# EAGLE design PCM2904DAC_ADC (EAGLE 8.3.2)
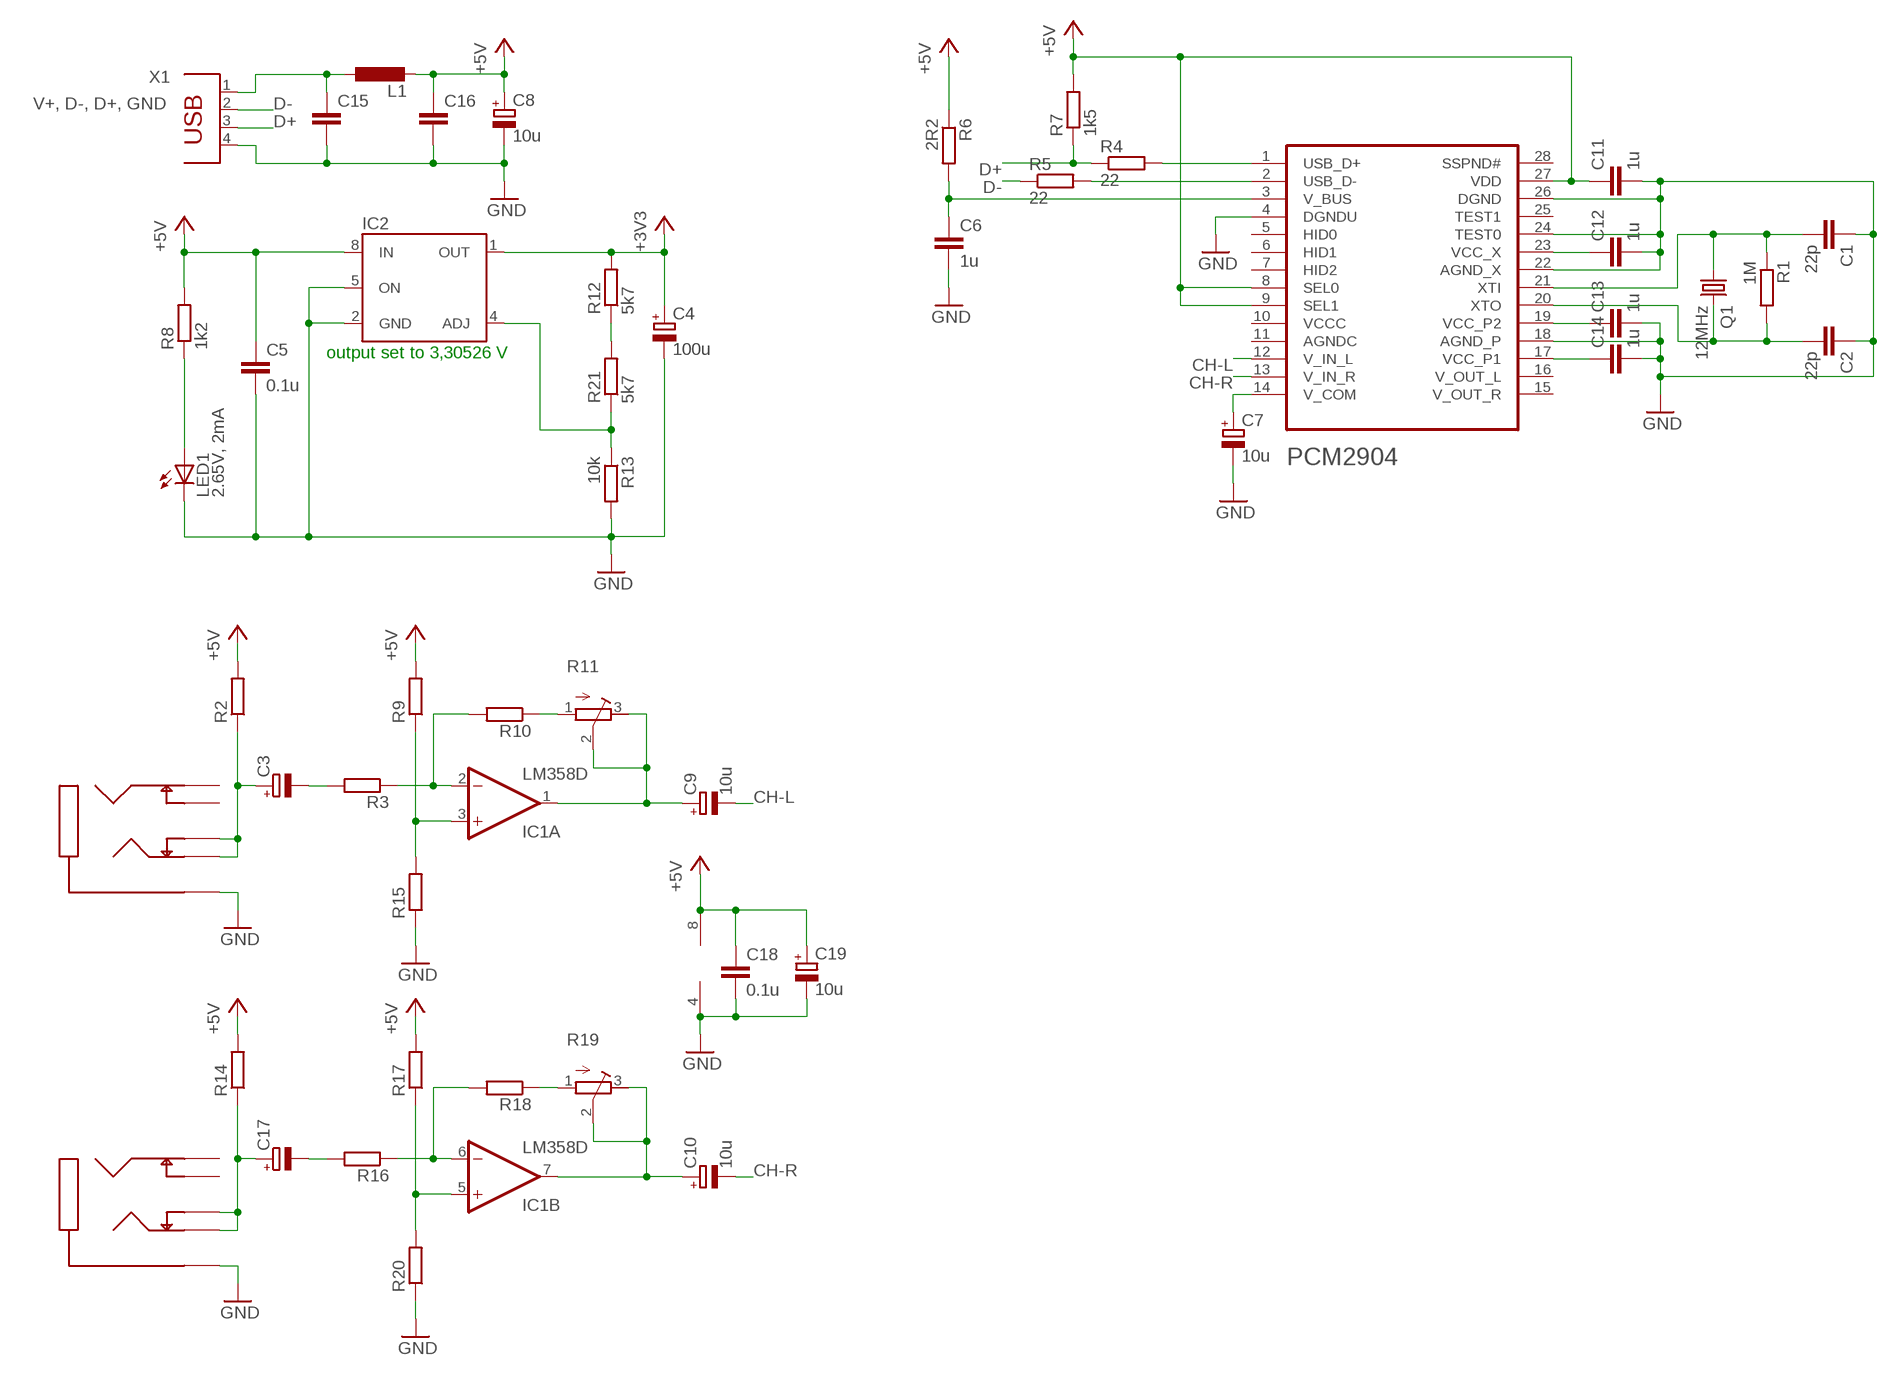
[diagram p0: schematic, sheet 1]

## Parts
C1  22p  C-EUC1206  [C1206]
C2  22p  C-EUC1206  [C1206]
C3  CPOL-EU153CLV-0505  [153CLV-0505]
C4  100u  CPOL-EU153CLV-0807  [153CLV-0807]
C5  0.1u  C-EUC1206  [C1206]
C6  1u  C-EUC1206  [C1206]
C7  10u  CPOL-EU153CLV-0505  [153CLV-0505]
C8  10u  CPOL-EU153CLV-0505  [153CLV-0505]
C9  10u  CPOL-EU153CLV-0505  [153CLV-0505]
C10  10u  CPOL-EU153CLV-0505  [153CLV-0505]
C11  1u  C-EUC1206  [C1206]
C12  1u  C-EUC1206  [C1206]
C13  1u  C-EUC1206  [C1206]
C14  1u  C-EUC1206  [C1206]
C15  C-EUC1206K  [C1206K]
C16  C-EUC1206K  [C1206K]
C17  CPOL-EU153CLV-0505  [153CLV-0505]
C18  0.1u  C-EUC1206  [C1206]
C19  10u  CPOL-EU153CLV-0505  [153CLV-0505]
IC1  LM358D  [SO08]
IC2  LM2931-ADJM  [SO08]
L1  L-EU0207/7  [0207/7]
LED1  2.65V, 2mA  LEDCHIPLED_0805  [CHIPLED_0805]
PCM2904  PCM2904  [SSOP28]
Q1  12MHz  CRYSTALHC49U-V  [HC49U-V]
R1  1M  R-EU_R1206  [R1206]
R2  R-EU_R1206W  [R1206W]
R3  R-EU_R1206W  [R1206W]
R4  22  R-EU_R1206  [R1206]
R5  22  R-EU_R1206  [R1206]
R6  2R2  R-EU_R1206  [R1206]
R7  1k5  R-EU_R1206  [R1206]
R8  1k2  R-EU_R1206  [R1206]
R9  R-EU_R1206W  [R1206W]
R10  R-EU_R1206W  [R1206W]
R11  R-TRIMM64W  [RTRIM64W]
R12  5k7  R-EU_R1206  [R1206]
R13  10k  R-EU_R1206  [R1206]
R14  R-EU_R1206W  [R1206W]
R15  R-EU_R1206W  [R1206W]
R16  R-EU_R1206W  [R1206W]
R17  R-EU_R1206W  [R1206W]
R18  R-EU_R1206W  [R1206W]
R19  R-TRIMM64W  [RTRIM64W]
R20  R-EU_R1206W  [R1206W]
R21  5k7  R-EU_R1206  [R1206]
U$1  1/8STEREO  [1/8STEREO]
U$8  1/8STEREO  [1/8STEREO]
X1  V+, D-, D+, GND  PN61729  [PN61729]

## Nets
+3V3: C4.+ IC2.1(OUT) R12.2
+5V: C5.1 C8.+ C11.1 C16.1 C18.1 C19.+ IC1.8(P:V+) IC2.8(IN) L1.2 PCM2904.8(SEL0) PCM2904.9(SEL1) PCM2904.27(VDD) R2.2 R6.1 R7.2 R8.2 R9.2 R14.2 R17.2
CH-L: C9.- PCM2904.12(V_IN_L)
CH-R: C10.- PCM2904.13(V_IN_R)
D+: R4.1 R7.1 X1.3
D-: R5.1 X1.2
GND: C1.1 C2.1 C4.- C5.2 C6.2 C7.- C8.- C11.2 C12.2 C13.2 C14.2 C15.2 C16.2 C18.2 C19.- IC1.4(P:V-) IC2.2(GND) IC2.5(ON) LED1.C PCM2904.4(DGNDU) PCM2904.18(AGND_P) PCM2904.22(AGND_X) PCM2904.24(TEST0) PCM2904.26(DGND) R13.2 R15.1 R20.1 U$1.P$1 U$8.P$1 X1.4
N$1: C1.2 PCM2904.21(XTI) Q1.1 R1.1
N$2: C2.2 PCM2904.20(XTO) Q1.2 R1.2
N$4: PCM2904.1(USB_D+) R4.2
N$5: C3.+ R2.1 U$8.P$4 U$8.P$5
N$6: PCM2904.2(USB_D-) R5.2
N$7: C17.+ R14.1 U$1.P$4 U$1.P$5
N$8: C15.1 L1.1 X1.1
N$9: C17.- R16.2
N$10: IC1.6(B:-IN) R16.1 R18.2
N$11: C6.1 PCM2904.3(V_BUS) R6.2
N$12: R18.1 R19.1(A)
N$13: C3.- R3.2
N$14: C10.+ IC1.7(B:OUT) R19.2(S) R19.3(E)
N$15: IC1.2(A:-IN) R3.1 R10.2
N$16: C7.+ PCM2904.14(V_COM)
N$17: R10.1 R11.1(A)
N$18: C9.+ IC1.1(A:OUT) R11.2(S) R11.3(E)
N$19: IC1.3(A:+IN) R9.1 R15.2
N$20: C14.1 PCM2904.17(VCC_P1)
N$21: C13.1 PCM2904.19(VCC_P2)
N$22: IC1.5(B:+IN) R17.1 R20.2
N$23: R12.1 R21.2
N$24: C12.1 PCM2904.23(VCC_X)
N$25: LED1.A R8.1
N$26: IC2.4(ADJ) R13.1 R21.1
Unconnected: PCM2904.5(HID0) PCM2904.6(HID1) PCM2904.7(HID2) PCM2904.10(VCCC) PCM2904.11(AGNDC) PCM2904.15(V_OUT_R) PCM2904.16(V_OUT_L) PCM2904.25(TEST1) PCM2904.28(SSPND#) U$1.P$2 U$1.P$3 U$8.P$2 U$8.P$3

## Notes on the sheet
- output set to 3,30526 V

## Library data of the parts
C1 C2 C5 C6 C11-C16 C18 = rcl:C-EU: CAPACITOR, European symbol
C3 C4 C7-C10 C17 C19 = rcl:CPOL-EU: POLARIZED CAPACITOR, European symbol
IC1 = linear:LM358: OP AMP also LM158; LM258; LM2904 Source: http://cache.national.com/ds/LM/LM158.pdf
IC2 = bt_regulator:LM2931-ADJ: LM2931 Low Dropout Adjustable Regulator, Automotive Input voltage: 26V max 3.3V, 5V, adjustable versions Output Current in Excess of 100 mA Very Low Quiescent Current Dropout Voltage < 0.6V Reverse Battery Protection 60V Load Dump Protection −50V Reverse Transient Protection Short Circuit Protection Internal Thermal Overload Protection Designed originally for automotive applications, the LM2931-N and all regulated circuitry are protected from reverse battery installations or 2 battery jumps. During line transients, such as a load dump (60V) when the input voltage to the regulator can momentarily exceed the specified maximum operating voltage, the regulator will automatically shut down to protect both internal circuits and the load. The LM2931-N cannot be harmed by temporary mirror-image insertion. Familiar regulator features such as short circuit and thermal overload protection are also provided. Datasheet.pdf <http://www.ti.com/lit/ds/symlink/lm2931-n.pdf>
L1 = rcl:L-EU: INDUCTOR, European symbol
LED1 = led:LED: LED OSRAM: - CHIPLED LG R971, LG N971, LY N971, LG Q971, LY Q971, LO R971, LY R971 LH N974, LH R974 LS Q976, LO Q976, LY Q976 LO Q996 - Hyper CHIPLED LW Q18S LB Q993, LB Q99A, LB R99A - SideLED LS A670, LO A670, LY A670, LG A670, LP A670 LB A673, LV A673, LT A673, LW A673 LH A674 LY A675 LS A676, LA A676, LO A676, LY A676, LW A676 LS A679, LY A679, LG A679 - Hyper Micro SIDELED® LS Y876, LA Y876, LO Y876, LY Y876 LT Y87S - SmartLED LW L88C, LW L88S LB L89C, LB L89S, LG L890 LS L89K, LO L89K, LY L89K LS L896, LA L896, LO L896, LY L896 - TOPLED LS T670, LO T670, LY T670, LG T670, LP T670 LSG T670, LSP T670, LSY T670, LOP T670, LYG T670 LG T671, LOG T671, LSG T671 LB T673, LV T673, LT T673, LW T673 LH T674 LS T676, LA T676, LO T676, LY T676, LB T676, LH T676, LSB T676, LW T676 LB T67C, LV T67C, LT T67C, LS T67K, LO T67K, LY T67K, LW E67C LS E67B, LA E67B, LO E67B, LY E67B, LB E67C, LV E67C, LT E67C LW T67C LS T679, LY T679, LG T679 LS T770, LO T770, LY T770, LG T770, LP T770 LB T773, LV T773, LT T773, LW T773 LH T774 LS E675, LA E675, LY E675, LS T675 LS T776, LA T776, LO T776, LY T776, LB T776 LHGB T686 LT T68C, LB T68C - Hyper Mini TOPLED® LB M676 - Mini TOPLED Santana® LG M470 LS M47K, LO M47K, LY M47K Source: http://www.osram.convergy.de LUXEON: - LUMILED® LXK2-PW12-R00, LXK2-PW12-S00, LXK2-PW14-U00, LXK2-PW14-V00 LXK2-PM12-R00, LXK2-PM12-S00, LXK2-PM14-U00 LXK2-PE12-Q00, LXK2-PE12-R00, LXK2-PE12-S00, LXK2-PE14-T00, LXK2-PE14-U00 LXK2-PB12-K00, LXK2-PB12-L00, LXK2-PB12-M00, LXK2-PB14-N00, LXK2-PB14-P00, LXK2-PB14-Q00 LXK2-PR12-L00, LXK2-PR12-M00, LXK2-PR14-Q00, LXK2-PR14-R00 LXK2-PD12-Q00, LXK2-PD12-R00, LXK2-PD12-S00 LXK2-PH12-R00, LXK2-PH12-S00 LXK2-PL12-P00, LXK2-PL12-Q00, LXK2-PL12-R00 Source: www.luxeon.com KINGBRIGHT: KA-3528ASYC Source: www.kingbright.com
PCM2904 = PCM2904:PCM2904
Q1 = crystal:CRYSTAL: CRYSTAL; OC_FARNELL: 1666969; OC_NEWARK: unknown
R1-R10 R12-R18 R20 R21 = rcl:R-EU_: RESISTOR, European symbol
R11 R19 = rcl:R-TRIMM: Trimm resistor
U$1 U$8 = bleep t2:1/8STEREO
X1 = con-berg:PN61729: BERG USB connector; OC_FARNELL: unknown; OC_NEWARK: unknown

## Board
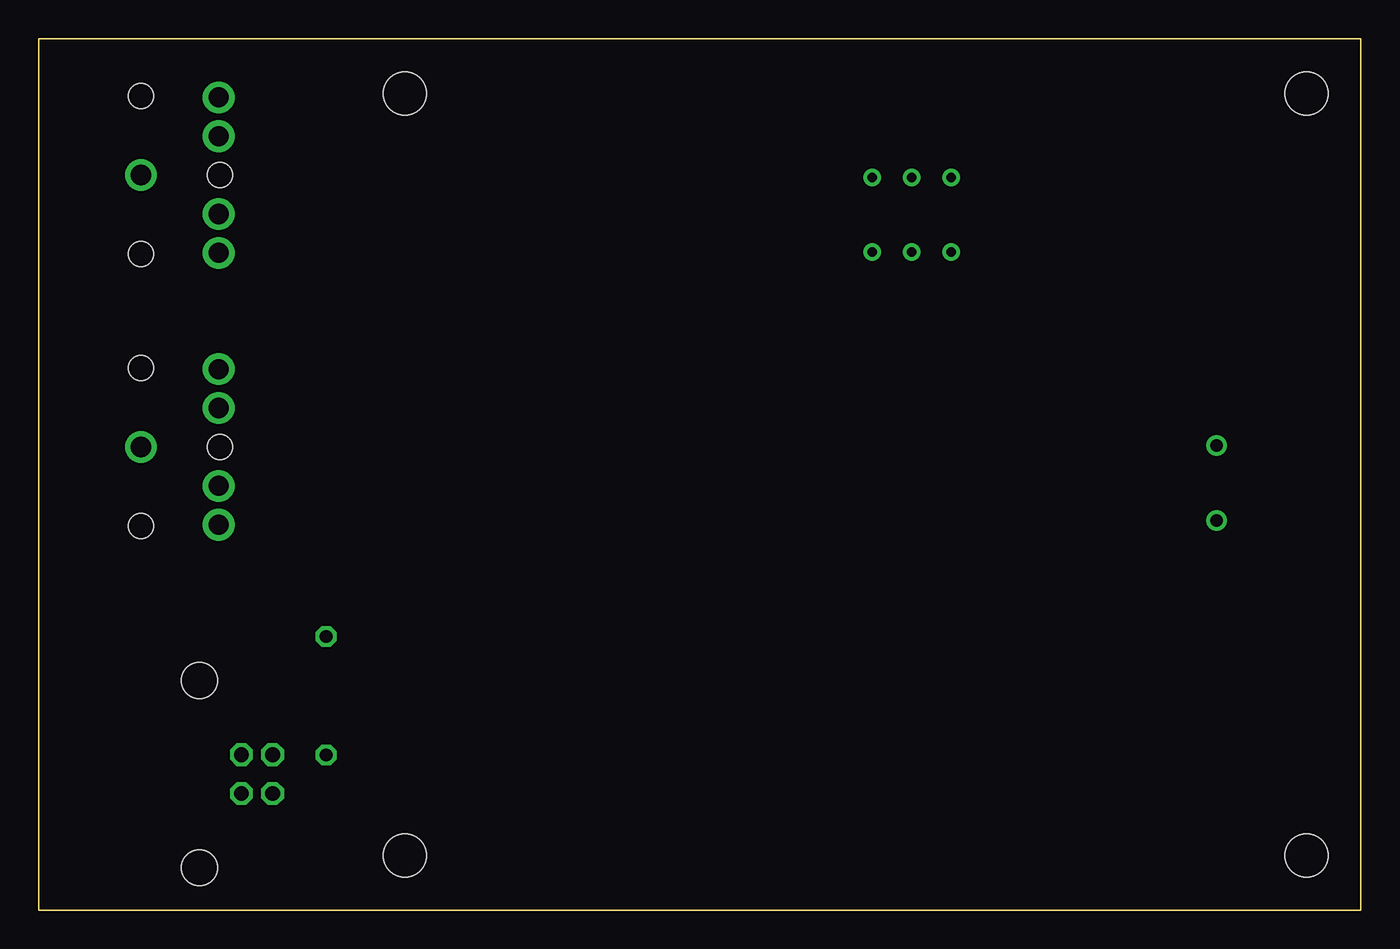
[diagram p1: board, top side]
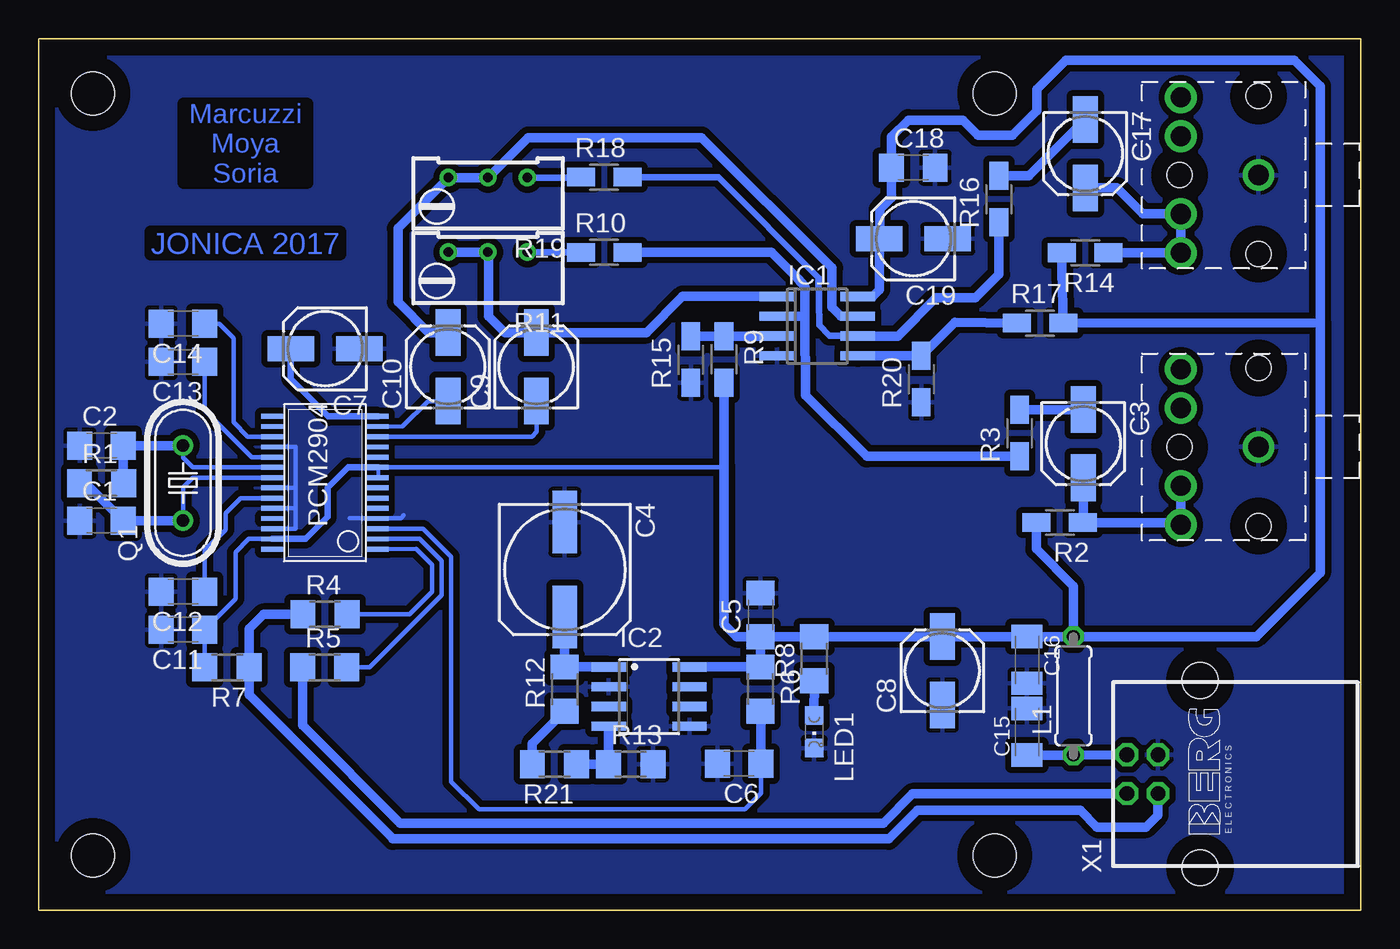
[diagram p2: board, bottom side, seen from below]

Size 85 x 56 mm. Coordinates in mm from the lower left corner, seen from the top.
Outline: 85,0 85,56 0,56 0,0 85,0
Copper layers (1*16): Top 0.035mm / dielectric 1.5mm / Bottom 0.035mm
Design rules "default": minimum track width 6mil, minimum drill 0.35mm, track to track 6mil, track to pad 6mil, pad to pad 6mil, via to via 6mil, smd to smd 6mil, copper to edge 40mil, drill to drill 6mil, minimum pad ring 10mil, minimum via ring 8mil, stop-mask expansion 4mil, vias tented up to drill 0mil, thermal gap 10mil
Holes 2.75 mm at 23.53,3.5 81.53,3.5 81.53,52.5 23.53,52.5

### Footprints (pad centres in the part's own frame; a part is rotated, then mirrored left to right if it is on the bottom)
C1206 = smd 1.6 x 1.8: 1 -1.4,0; 2 1.4,0
153CLV-0505 = smd 3 x 1.6: + 2.2,0; - -2.2,0
153CLV-0807 = smd 4 x 1.6: + 3.05,0; - -3.05,0
C1206K = smd 1.5 x 2: 1 -1.5,0; 2 1.5,0
SO08 = smd 0.6 x 2.2: 1 -1.905,-2.6; 2 -0.635,-2.6; 3 0.635,-2.6; 4 1.905,-2.6; 5 1.905,2.6; 6 0.635,2.6; 7 -0.635,2.6; 8 -1.905,2.6
0207/7 = drill 0.813 octagon: 1 -3.81,0; 2 3.81,0
CHIPLED_0805 = smd 1.2 x 1.2: A 0,-1.05; C 0,1.05
SSOP28 = smd 0.305 x 1.397: 1 -4.039,-2.856; 2 -3.384,-2.856; 3 -2.729,-2.856; 4 -2.064,-2.856; 5 -1.409,-2.856; 6 -0.764,-2.856; 7 -0.099,-2.856; 8 0.556,-2.856; 9 1.221,-2.856; 10 1.866,-2.856; 11 2.531,-2.856; 12 3.186,-2.856; 13 3.841,-2.856; 14 4.496,-2.856; 15 4.496,3.937; 16 3.841,3.937; 17 3.186,3.937; 18 2.531,3.937; 19 1.866,3.937; 20 1.221,3.937; 21 0.556,3.937; 22 -0.099,3.937; 23 -0.764,3.937; 24 -1.409,3.937; 25 -2.064,3.937; 26 -2.729,3.937; 27 -3.384,3.937; 28 -4.039,3.937
HC49U-V = drill 0.813: 1 -2.413,0; 2 2.413,0
R1206 = smd 1.6 x 1.803: 1 -1.422,0; 2 1.422,0
R1206W = smd 1.8 x 1.2: 1 -1.499,0; 2 1.499,0
RTRIM64W = drill 0.61: 1 1.27,-2.54; 2 1.27,0; 3 1.27,2.54
1/8STEREO = drill 1.3 pad 2.032: P$1 0,0; P$2 5,-5; P$3 5,-2.5; P$4 5,2.5; P$5 5,5 | hole 1.6: 0,5.08; 5.08,0; 0,-5.08
PN61729 = drill 0.95 octagon: 1 1.25,4.71; 2 -1.25,4.71; 3 -1.25,2.71; 4 1.25,2.71 | hole 2.3: -6.02,0; 6.02,0

### Placement (x,y rotation side)
C1  80.96,25.03 0 bottom
C2  80.96,29.85 0 bottom
C3  17.84,29.99 270 bottom
C4  51.18,21.89 270 bottom
C5  38.59,18.98 90 bottom
C6  39.97,9.41 180 bottom
C7  66.6,36.08 180 bottom
C8  26.9,15.38 90 bottom
C9  53.01,34.92 90 bottom
C10  58.69,34.92 90 bottom
C11  75.73,18.02 180 bottom
C12  75.73,20.46 180 bottom
C13  75.73,35.24 180 bottom
C14  75.73,37.7 180 bottom
C15  21.46,11.46 90 bottom
C16  21.46,16.08 270 bottom
C17  17.71,48.62 270 bottom
C18  28.76,47.73 0 bottom
C19  28.76,43.15 180 bottom
IC1  34.95,37.53 270 bottom
IC2  45.75,13.72 270 bottom
L1  18.47,13.77 90 bottom
LED1  35.14,11.46 180 bottom
PCM2904  66.06,27.24 90 bottom
Q1  75.73,27.46 90 bottom
R1  80.96,27.44 0 bottom
R2  19.36,24.91 180 bottom
R3  21.93,30.66 90 bottom
R4  66.6,19.01 0 bottom
R5  66.62,15.6 0 bottom
R6  38.59,14.2 270 bottom
R7  72.91,15.6 180 bottom
R8  35.14,16.15 90 bottom
R9  40.94,35.39 270 bottom
R10  48.65,42.28 0 bottom
R11  56.12,41.02 90 bottom
R12  51.18,14.2 90 bottom
R13  46.94,9.37 0 bottom
R14  17.71,42.25 180 bottom
R15  43.08,35.39 90 bottom
R16  23.26,45.71 90 bottom
R17  20.61,37.73 0 bottom
R18  48.65,47.11 0 bottom
R19  56.12,45.81 90 bottom
R20  28.25,34.13 90 bottom
R21  51.85,9.37 180 bottom
U$1  6.56,47.24 180 bottom
U$8  6.56,29.77 180 bottom
X1  10.32,8.74 90 bottom

### Tracks (layer width: path | path; a pad name or v marks a point on that pad's centre or on a via)
+3V3
  Bottom 0.61: C4.+ R12.2 IC2.1
+5V
  Bottom 0.254: PCM2904.8 PCM2904.9 62.7,28.45
  Bottom 0.305: PCM2904.9 40.94,28.47 40.94,28.5 | PCM2904.27 71.51,23.85 72.35,23.01 72.35,20 C11.1 R7.2
  Bottom 0.406: PCM2904.27 67.85,23.85 66.43,25.27 66.43,27.15 65.11,28.47 63.2,28.47 PCM2904.9
  Bottom 0.61: IC2.8 R6.1 C5.1 | L1.2 C16.1 C8.+ 35.13,17.58 R8.2 C5.1 | C5.1 40.15,17.58 40.94,18.37 40.94,28.5 R9.2 | L1.2 6.71,17.58 2.6,21.69 2.6,37.85 | 30.95,43.16 C19.+ | IC1.8 31.39,39.44 30.95,39.88 30.95,43.16 | 30.95,43.16 30.92,43.19 30.92,45.03 30.16,45.8 C18.1 30.16,49.71 29.09,50.77 25.59,50.77 24.62,49.8 22.38,49.8 20.8,51.38 20.8,52.77 18.94,54.63 4.27,54.63 2.6,52.96 2.6,37.85 | 2.6,37.85 2.67,37.75 R17.2 19.21,41.01 R14.2 | R2.2 20.86,23.21 18.48,20.83 L1.2
CH-L
  Bottom 0.305: PCM2904.12 53.3,30.43 53,30.73 53,32.7 C9.-
CH-R
  Bottom 0.305: PCM2904.13 61.61,31.09 59.98,32.72 C10.-
D+
  Bottom 0.305: 62.24,4.57 62.24,4.6
  Bottom 0.61: 62.24,4.57 30.34,4.57 28.51,6.4 18.02,6.4 16.95,5.33 13.8,5.33 13.04,6.1 13.04,7.47 X1.3 | 68.03,19 R4.1 70.56,19.01 71.49,18.09 R7.1 71.48,13.84 62.24,4.6
D-
  Bottom 0.61: X1.2 16.08,7.47 28.82,7.47 30.7,5.59 61.76,5.59 68.04,11.87 R5.1
GND
  Bottom 0.305: 61.53,25.38 61.72,25.18 PCM2904.4 65.01,25.17 | PCM2904.26 68.49,24.51 68.49,25.83 | 68.49,25.83 PCM2904.24 | 68.49,27.14 PCM2904.22 | 68.49,27.14 68.49,25.83 | PCM2904.18 68.49,29.77 68.49,27.14
  pour Bottom (isolate 0.406): 85,56.01 -0.13,56.01 0.1,0.07 85,0
N$1
  Bottom 0.305: PCM2904.21 75.11,27.79 75.73,27.17 Q1.1
  Bottom 0.61: R1.1 81.98,27.44 C1.2 75.74,25.03 Q1.1
N$2
  Bottom 0.305: PCM2904.20 75.1,28.46 75.73,29.09 75.73,29.77 Q1.2
  Bottom 0.61: 75.73,29.77 75.73,29.85 C2.2 79.57,27.44 R1.2
N$4
  Bottom 0.305: PCM2904.1 60.74,23.21 59.73,22.2 59.73,20.47 61.18,19.02 64.68,19.02 R4.2
N$5
  Bottom 0.61: U$8.P$4 U$8.P$5 11.7,24.91 R2.1 17.84,24.93 C3.+
N$6
  Bottom 0.254: 62.72,23.85 PCM2904.2
  Bottom 0.305: PCM2904.2 60.52,23.85 59.12,22.45 59.12,20.22 63.74,15.6 R5.2
N$7
  Bottom 0.61: R14.1 U$1.P$5 U$1.P$4 11.58,44.76 14.01,44.76 15.68,46.42 C17.+
N$8
  Bottom 0.254: X1.1 16.07,9.96
  Bottom 0.61: C15.1 L1.1 X1.1
N$9
  Bottom 0.61: R16.2 21.33,47.21 C17.-
N$10
  Bottom 0.254: 32.35,37.03 IC1.6
  Bottom 0.406: IC1.6 34.17,36.91 34.81,37.59 34.86,40.64 41.28,47.11 R18.2
  Bottom 0.61: IC1.6 29.77,36.9 27.32,39.34 24.78,39.34 23.25,40.87 R16.1
N$11
  Bottom 0.305: C6.1 38.57,7.49 39.59,6.48 56.7,6.48 58.48,8.26 58.48,22.71 60.28,24.51 PCM2904.3
  Bottom 0.61: C6.1 38.57,12.52 R6.2
N$12
  Bottom 0.406: R18.1 50.18,47.08 R19.1
N$13
  Bottom 0.61: R3.2 17.87,32.16 C3.-
N$14
  Bottom 0.61: C10.+ 59.94,37.12 61.91,39.09 61.91,43.82 R19.3 R19.2 53.53,49.66 42.38,49.66 34,41.27 34,38.73 33.43,38.17 IC1.7
N$15
  Bottom 0.61: 35.72,38.17 35.72,40.06 36.23,40.62 37.89,42.28 R10.2 | IC1.2 35.72,38.17 | 35.72,38.17 35.72,38.15 35.7,33.1 31.76,29.16 R3.1
N$16
  Bottom 0.406: PCM2904.14 66.39,31.73 68.8,34.14 C7.+
N$17
  Bottom 0.406: R10.1 50.17,42.3 R11.1
N$18
  Bottom 0.61: R11.3 R11.2 56.1,42.26 56.1,38.18 55.04,37.12 C9.+ 45.93,37.12 43.6,39.45 IC1.1
N$19
  Bottom 0.254: 37.56,36.89 IC1.3
  Bottom 0.61: R9.1 IC1.3 | R9.1 | R15.2 R9.1
N$20
  Bottom 0.305: PCM2904.17 71.56,30.42 72.48,31.34 72.48,36.75 73.42,37.69 C14.1
N$21
  Bottom 0.305: PCM2904.19 71.3,29.1 74.33,32.13 C13.1
N$22
  Bottom 0.254: IC1.5 | 28.38,35.63 R20.2
  Bottom 0.61: IC1.5 R20.2 26.1,37.78 R17.1
N$23
  Bottom 0.6: R21.2 53.27,10.69 R12.1
N$24
  Bottom 0.305: C12.1 74.33,23.11 72.99,24.46 72.99,25.5 72.02,26.47 PCM2904.23
N$25
  Bottom 0.61: R8.1 LED1.A
N$26
  Bottom 0.6: IC2.4 48.35,9.38 R13.1 R21.1

### Text on the board
Bottom: Marcuzzi / Moya / Soria | JONICA 2017